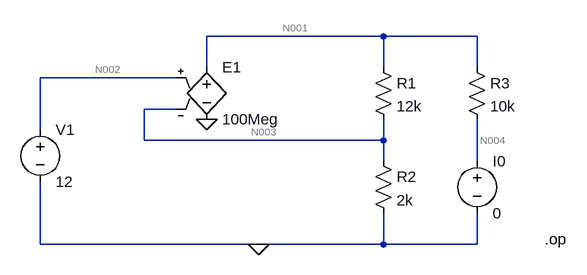
[diagram p0: schematic HW05P01.asc]
HW05P01.asc, the LTspice schematic file:
Version 4
SHEET 1 880 680
WIRE 592 -32 320 -32
WIRE 736 -32 592 -32
WIRE 320 16 320 -32
WIRE 592 16 592 -32
WIRE 736 16 736 -32
WIRE 272 32 64 32
WIRE 272 80 224 80
WIRE 64 112 64 32
WIRE 224 128 224 80
WIRE 592 128 592 96
WIRE 592 128 224 128
WIRE 592 160 592 128
WIRE 736 160 736 96
WIRE 64 288 64 192
WIRE 400 288 64 288
WIRE 592 288 592 240
WIRE 592 288 400 288
WIRE 736 288 736 240
WIRE 736 288 592 288
FLAG 320 96 0
FLAG 400 288 0
DATAFLAG 432 -32 ""
SYMBOL voltage 64 96 R0
SYMATTR InstName V1
SYMATTR Value 12
SYMBOL e 320 0 R0
SYMATTR InstName E1
SYMATTR Value 100Meg
SYMBOL res 576 0 R0
SYMATTR InstName R1
SYMATTR Value 12k
SYMBOL res 576 144 R0
SYMATTR InstName R2
SYMATTR Value 2k
SYMBOL res 720 0 R0
SYMATTR InstName R3
SYMATTR Value 10k
SYMBOL voltage 736 144 R0
SYMATTR InstName I0
SYMATTR Value 0
TEXT 840 280 Left 2 !.op

The netlist it stands for:
* HW05P01.asc
V1 N002 0 12
E1 N001 0 N002 N003 100Meg
R1 N001 N003 12k
R2 N003 0 2k
R3 N001 N004 10k
V§I0 N004 0 0
.op
.backanno
.end

* Results of the author's LTspice run, read from the files saved beside the schematic
* Operating Point:
*   V(n002) = 12 V
*   V(n001) = 84 V
*   V(n003) = 12 V
*   V(n004) = 0 V
*   I(R1) = 6 mA
*   I(R2) = 6 mA
*   I(R3) = 8.4 mA
*   I(E1) = -14.4 mA
*   I(V1) = 0 A
*   I(I0) = 8.4 mA